# EAGLE design v001 (EAGLE 6.4)
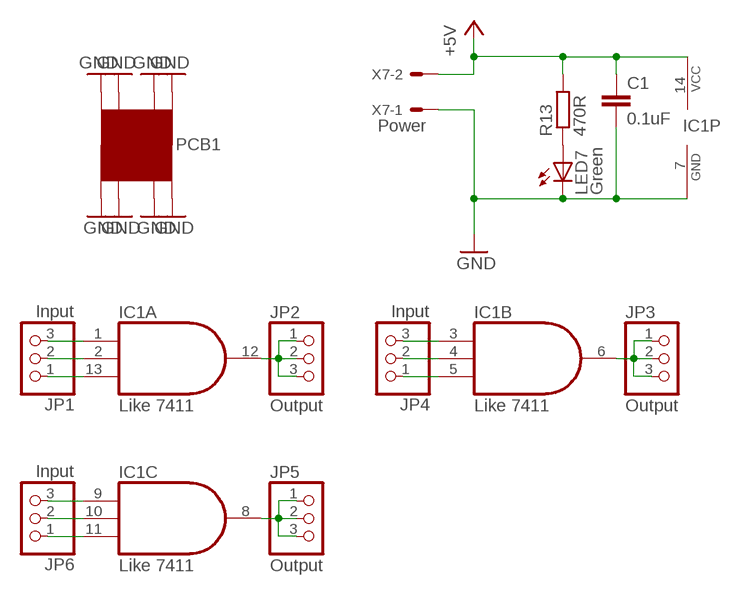
[diagram p0: schematic, sheet 1]

## Parts
C1  0.1uF  C-EU050-024X044  [C050-024X044]
IC1  Like 7411  74ALS11N  [DIL14]
JP1  Input  PINHD-1X3  [1X03]
JP2  Output  PINHD-1X3  [1X03]
JP3  Output  PINHD-1X3  [1X03]
JP4  Input  PINHD-1X3  [1X03]
JP5  Output  PINHD-1X3  [1X03]
JP6  Input  PINHD-1X3  [1X03]
LED7  Green  LED3MM  [LED3MM]
PCB1  PCB05X05  [PCB_05X05]
R13  470R  R-EU_0204/7  [0204/7]
X7  Power  22-27-2021-02  [6410-02]

## Nets
+5V: C1.1 IC1.14(P:VCC) R13.2 X7.2
GND: C1.2 IC1.7(P:GND) LED7.K(C) PCB1.GND@1(GND) PCB1.GND@2(GND) PCB1.GND@3(GND) PCB1.GND@4(GND) PCB1.GND@5(GND) PCB1.GND@6(GND) PCB1.GND@7(GND) PCB1.GND@8(GND) X7.1
N$1: IC1.13(A:I2) JP1.1
N$2: IC1.2(A:I1) JP1.2
N$3: IC1.12(A:O) JP2.1 JP2.2 JP2.3
N$4: IC1.1(A:I0) JP1.3
N$5: LED7.A R13.1
N$6: IC1.5(B:I2) JP4.1
N$7: IC1.6(B:O) JP3.1 JP3.2 JP3.3
N$8: IC1.4(B:I1) JP4.2
N$9: IC1.3(B:I0) JP4.3
N$10: IC1.8(C:O) JP5.1 JP5.2 JP5.3
N$11: IC1.11(C:I2) JP6.1
N$12: IC1.10(C:I1) JP6.2
N$13: IC1.9(C:I0) JP6.3

## Library data of the parts
C1 = rcl:C-EU: CAPACITOR, European symbol
IC1 = 74xx-us:74*11: Triple 3-input AND gate
JP1-JP6 = pinhead:PINHD-1X3: PIN HEADER
LED7 = led:LED: LED OSRAM: - CHIPLED LG R971, LG N971, LY N971, LG Q971, LY Q971, LO R971, LY R971 LH N974, LH R974 LS Q976, LO Q976, LY Q976 LO Q996 - Hyper CHIPLED LW Q18S LB Q993, LB Q99A, LB R99A - SideLED LS A670, LO A670, LY A670, LG A670, LP A670 LB A673, LV A673, LT A673, LW A673 LH A674 LY A675 LS A676, LA A676, LO A676, LY A676, LW A676 LS A679, LY A679, LG A679 - Hyper Micro SIDELED® LS Y876, LA Y876, LO Y876, LY Y876 LT Y87S - SmartLED LW L88C, LW L88S LB L89C, LB L89S, LG L890 LS L89K, LO L89K, LY L89K LS L896, LA L896, LO L896, LY L896 - TOPLED LS T670, LO T670, LY T670, LG T670, LP T670 LSG T670, LSP T670, LSY T670, LOP T670, LYG T670 LG T671, LOG T671, LSG T671 LB T673, LV T673, LT T673, LW T673 LH T674 LS T676, LA T676, LO T676, LY T676, LB T676, LH T676, LSB T676, LW T676 LB T67C, LV T67C, LT T67C, LS T67K, LO T67K, LY T67K, LW E67C LS E67B, LA E67B, LO E67B, LY E67B, LB E67C, LV E67C, LT E67C LW T67C LS T679, LY T679, LG T679 LS T770, LO T770, LY T770, LG T770, LP T770 LB T773, LV T773, LT T773, LW T773 LH T774 LS E675, LA E675, LY E675, LS T675 LS T776, LA T776, LO T776, LY T776, LB T776 LHGB T686 LT T68C, LB T68C - Hyper Mini TOPLED® LB M676 - Mini TOPLED Santana® LG M470 LS M47K, LO M47K, LY M47K Source: http://www.osram.convergy.de LUXEON: - LUMILED® LXK2-PW12-R00, LXK2-PW12-S00, LXK2-PW14-U00, LXK2-PW14-V00 LXK2-PM12-R00, LXK2-PM12-S00, LXK2-PM14-U00 LXK2-PE12-Q00, LXK2-PE12-R00, LXK2-PE12-S00, LXK2-PE14-T00, LXK2-PE14-U00 LXK2-PB12-K00, LXK2-PB12-L00, LXK2-PB12-M00, LXK2-PB14-N00, LXK2-PB14-P00, LXK2-PB14-Q00 LXK2-PR12-L00, LXK2-PR12-M00, LXK2-PR14-Q00, LXK2-PR14-R00 LXK2-PD12-Q00, LXK2-PD12-R00, LXK2-PD12-S00 LXK2-PH12-R00, LXK2-PH12-S00 LXK2-PL12-P00, LXK2-PL12-Q00, LXK2-PL12-R00 Source: www.luxeon.com KINGBRIGHT: KA-3528ASYC Source: www.kingbright.com
PCB1 = GNLib:PCB
R13 = rcl:R-EU_: RESISTOR, European symbol
X7 = con-molex:22-?-02: CONNECTOR wire to board 2.54 mm (.1 inch) pitch header

## Board
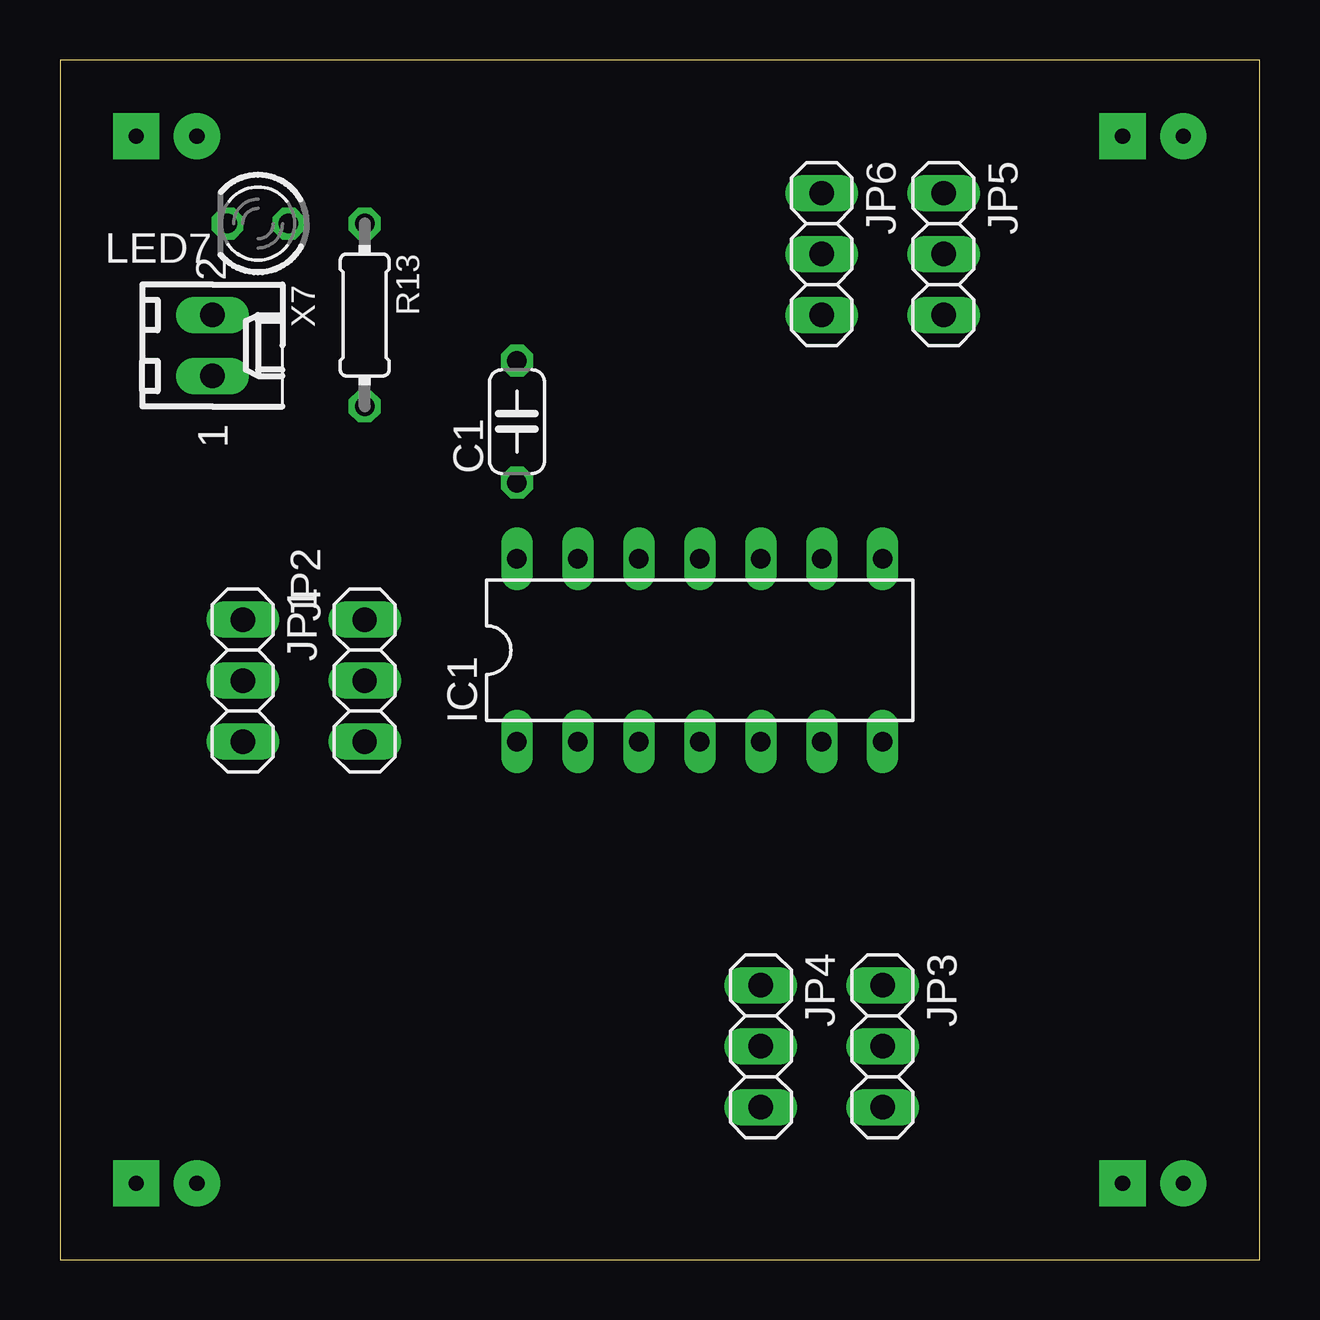
[diagram p1: board, top side]
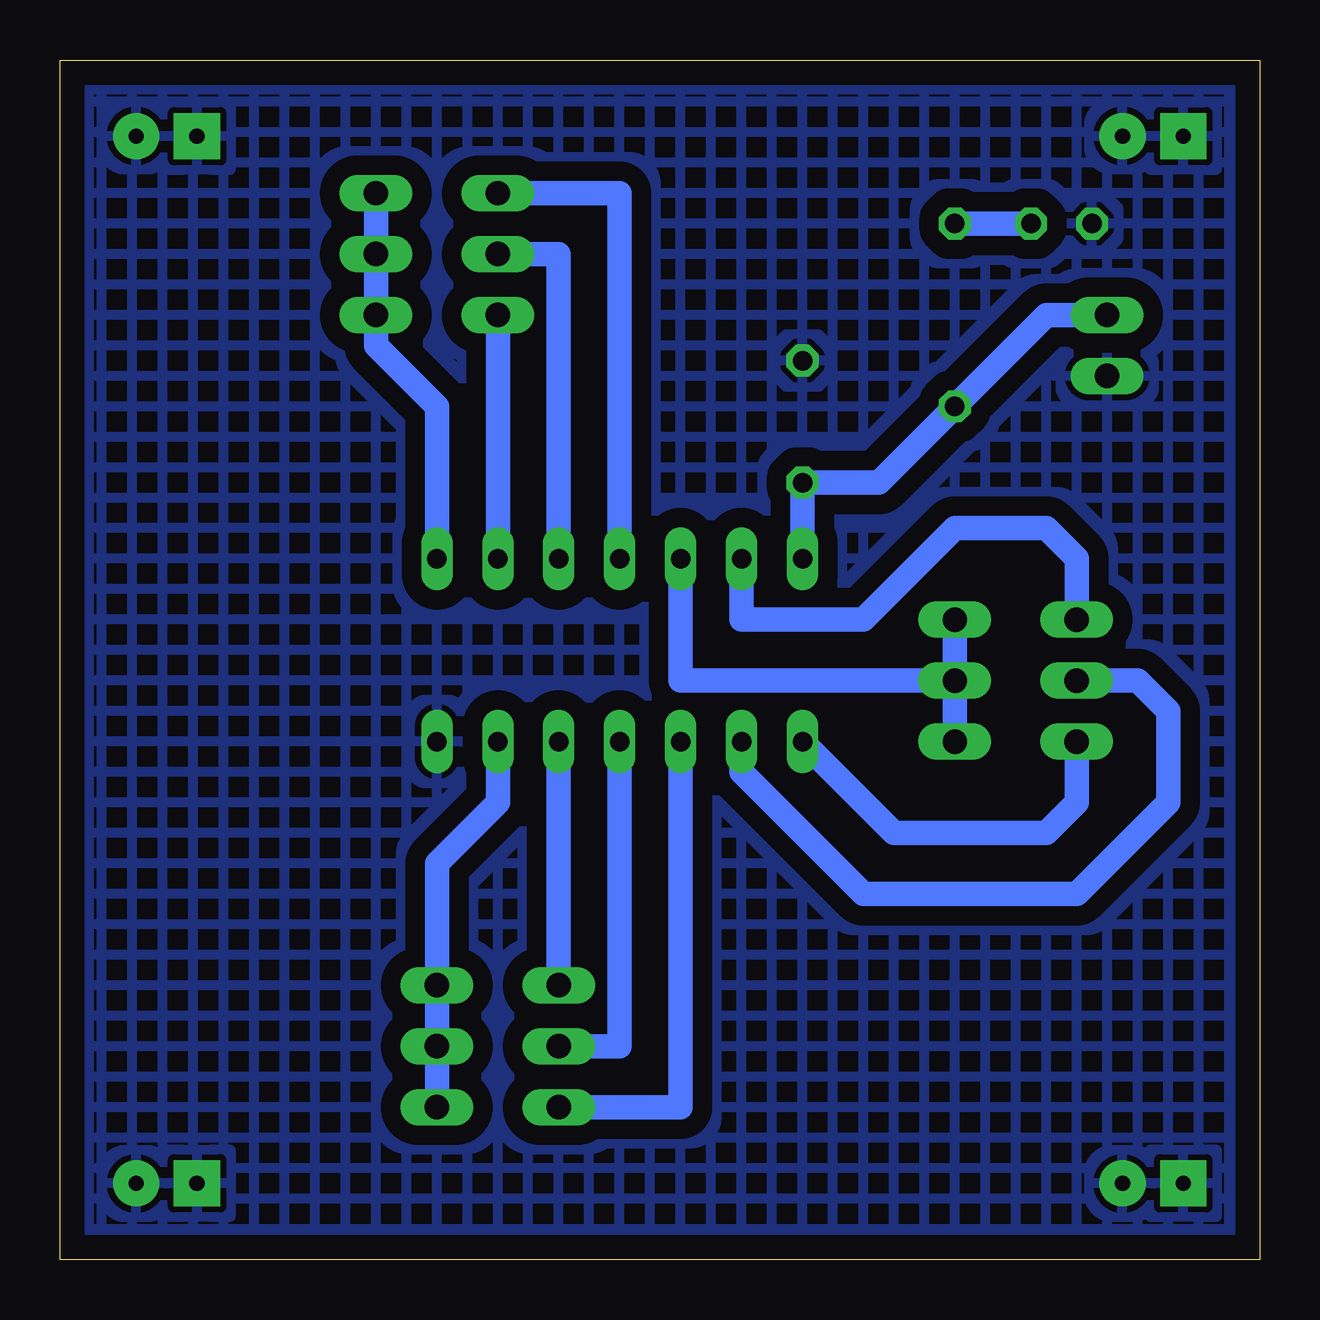
[diagram p2: board, bottom side, seen from below]

Size 50 x 50 mm. Coordinates in mm from the lower left corner, seen from the top.
Outline: 0,0 50,0 50,50 0,50 0,0
Copper layers (1*16): Top 0.035mm / dielectric 1.5mm / Bottom 0.035mm
Design rules "default": minimum track width 10mil, minimum drill 24mil, track to track 8mil, track to pad 8mil, pad to pad 8mil, via to via 8mil, smd to smd 8mil, copper to edge 40mil, drill to drill 8mil, minimum pad ring 10mil, minimum via ring 8mil, stop-mask expansion 4mil, vias tented up to drill 0mil, thermal gap 10mil

### Footprints (pad centres in the part's own frame; a part is rotated, then mirrored left to right if it is on the bottom)
C050-024X044 = drill 0.813 octagon: 1 -2.54,0; 2 2.54,0
DIL14 = drill 0.813 long: 1 -7.62,-3.81; 2 -5.08,-3.81; 3 -2.54,-3.81; 4 0,-3.81; 5 2.54,-3.81; 6 5.08,-3.81; 7 7.62,-3.81; 8 7.62,3.81; 9 5.08,3.81; 10 2.54,3.81; 11 0,3.81; 12 -2.54,3.81; 13 -5.08,3.81; 14 -7.62,3.81
1X03 = drill 1.016 long: 1 -2.54,0; 2 0,0; 3 2.54,0
LED3MM = drill 0.813 octagon: A -1.27,0; K 1.27,0
PCB_05X05 = drill 0.64 pad 1.93 square: GND@1 3.175,46.825; GND@2 44.285,46.825; GND@7 3.175,3.175; GND@8 44.285,3.175 | drill 0.64 pad 1.93: GND@3 46.825,46.825; GND@4 5.715,46.825; GND@5 46.825,3.175; GND@6 5.715,3.175
0204/7 = drill 0.813 octagon: 1 -3.81,0; 2 3.81,0
6410-02 = drill 1.016 long: 1 1.27,0; 2 -1.27,0

### Placement (x,y rotation side)
C1  19.05,34.92 90 top
IC1  26.67,25.4 0 top
JP1  7.62,24.13 270 top
JP2  12.7,24.13 90 top
JP3  34.29,8.89 270 top
JP4  29.21,8.89 270 top
JP5  36.83,41.91 270 top
JP6  31.75,41.91 270 top
LED7  8.26,43.18 180 top
PCB1  0,0 0 top
R13  12.7,39.37 270 top
X7  6.35,38.1 270 top

### Tracks (layer width: path | path; a pad name or v marks a point on that pad's centre or on a via)
+5V
  Bottom 1.016: X7.2 8.89,39.37 R13.2 15.88,32.38 C1.1 IC1.14
GND
  pour Bottom (isolate 0.813, hatched): 50.16,50.16 0,50.16 0,0 50.16,0
N$1
  Bottom 1.016: IC1.13 21.59,26.67 16.51,26.67 12.7,30.48 8.89,30.48 7.62,29.21 JP1.1
N$2
  Bottom 1.016: JP1.2 5.08,24.13 3.81,22.86 3.81,19.05 7.62,15.24 16.51,15.24 21.59,20.32 IC1.2
N$3
  Bottom 1.016: JP2.3 JP2.2 | JP2.2 JP2.1 | IC1.12 24.13,24.13 JP2.2
N$4
  Bottom 1.016: JP1.3 7.62,19.05 8.89,17.78 15.24,17.78 IC1.1
N$5
  Bottom 1.016: LED7.A R13.1
N$6
  Bottom 1.016: IC1.5 JP4.1
N$7
  Bottom 1.016: IC1.6 31.75,19.05 34.29,16.51 JP3.1 JP3.2 JP3.3
N$8
  Bottom 1.016: IC1.4 26.67,8.89 JP4.2
N$9
  Bottom 1.016: IC1.3 24.13,6.35 JP4.3
N$10
  Bottom 1.016: IC1.8 34.29,35.56 36.83,38.1 JP5.2 | JP5.2 JP5.3 | JP5.1 JP5.2
N$11
  Bottom 1.016: IC1.11 26.67,44.45 JP6.1
N$12
  Bottom 1.016: IC1.10 29.21,41.91 JP6.2
N$13
  Bottom 1.016: IC1.9 JP6.3